# Altium schematic sheet HardStop.SchDoc
size A
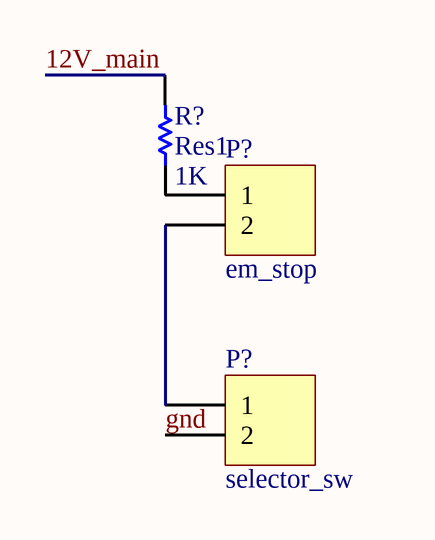
[diagram p0: HardStop.SchDoc]

## Parts
(Parts that share a designator on the sheet are numbered #1, #2 ... from top to bottom, then left to right.)
P?#1  em_stop  [HDR1X2H]
P?#2  selector_sw  [HDR1X2H]
R?  Res1  value 1K  [AXIAL-0.3]

## Nets
12V_main: R?.2
gnd: P?#2.2
NetP?#1_1: P?#1.1 R?.1
NetP?#1_2: P?#1.2 P?#2.1

## Library data of the parts
P?#1 P?#2 = Header 2H: Header, 2-Pin, Right Angle; LatestRevisionDate: 17-Jul-2002; LatestRevisionNote: Re-released for DXP Platform.; Publisher: Altium Limited
R? = Res1: Resistor; Published: 8-Jun-2000; LatestRevisionDate: 17-Jul-2002; LatestRevisionNote: Re-released for DXP Platform.; PackageReference: AXIAL-0.3; Publisher: Altium Limited; PackageDescription: Axial Device, Thru-Hole; 2 Leads; 0.3 in Pin Spacing